# Altium schematic sheet 5_MISC.SchDoc: SmartHalo - Misc
size B; Author: Sébastien Gélinas; Organization: SmartHalo; Address1: 5445 de Gaspé; Address2: Montréal, QC; Address3: Canada; Address4: H2T 3B2; Revision: 1; SheetNumber: 5; SheetTotal: 7
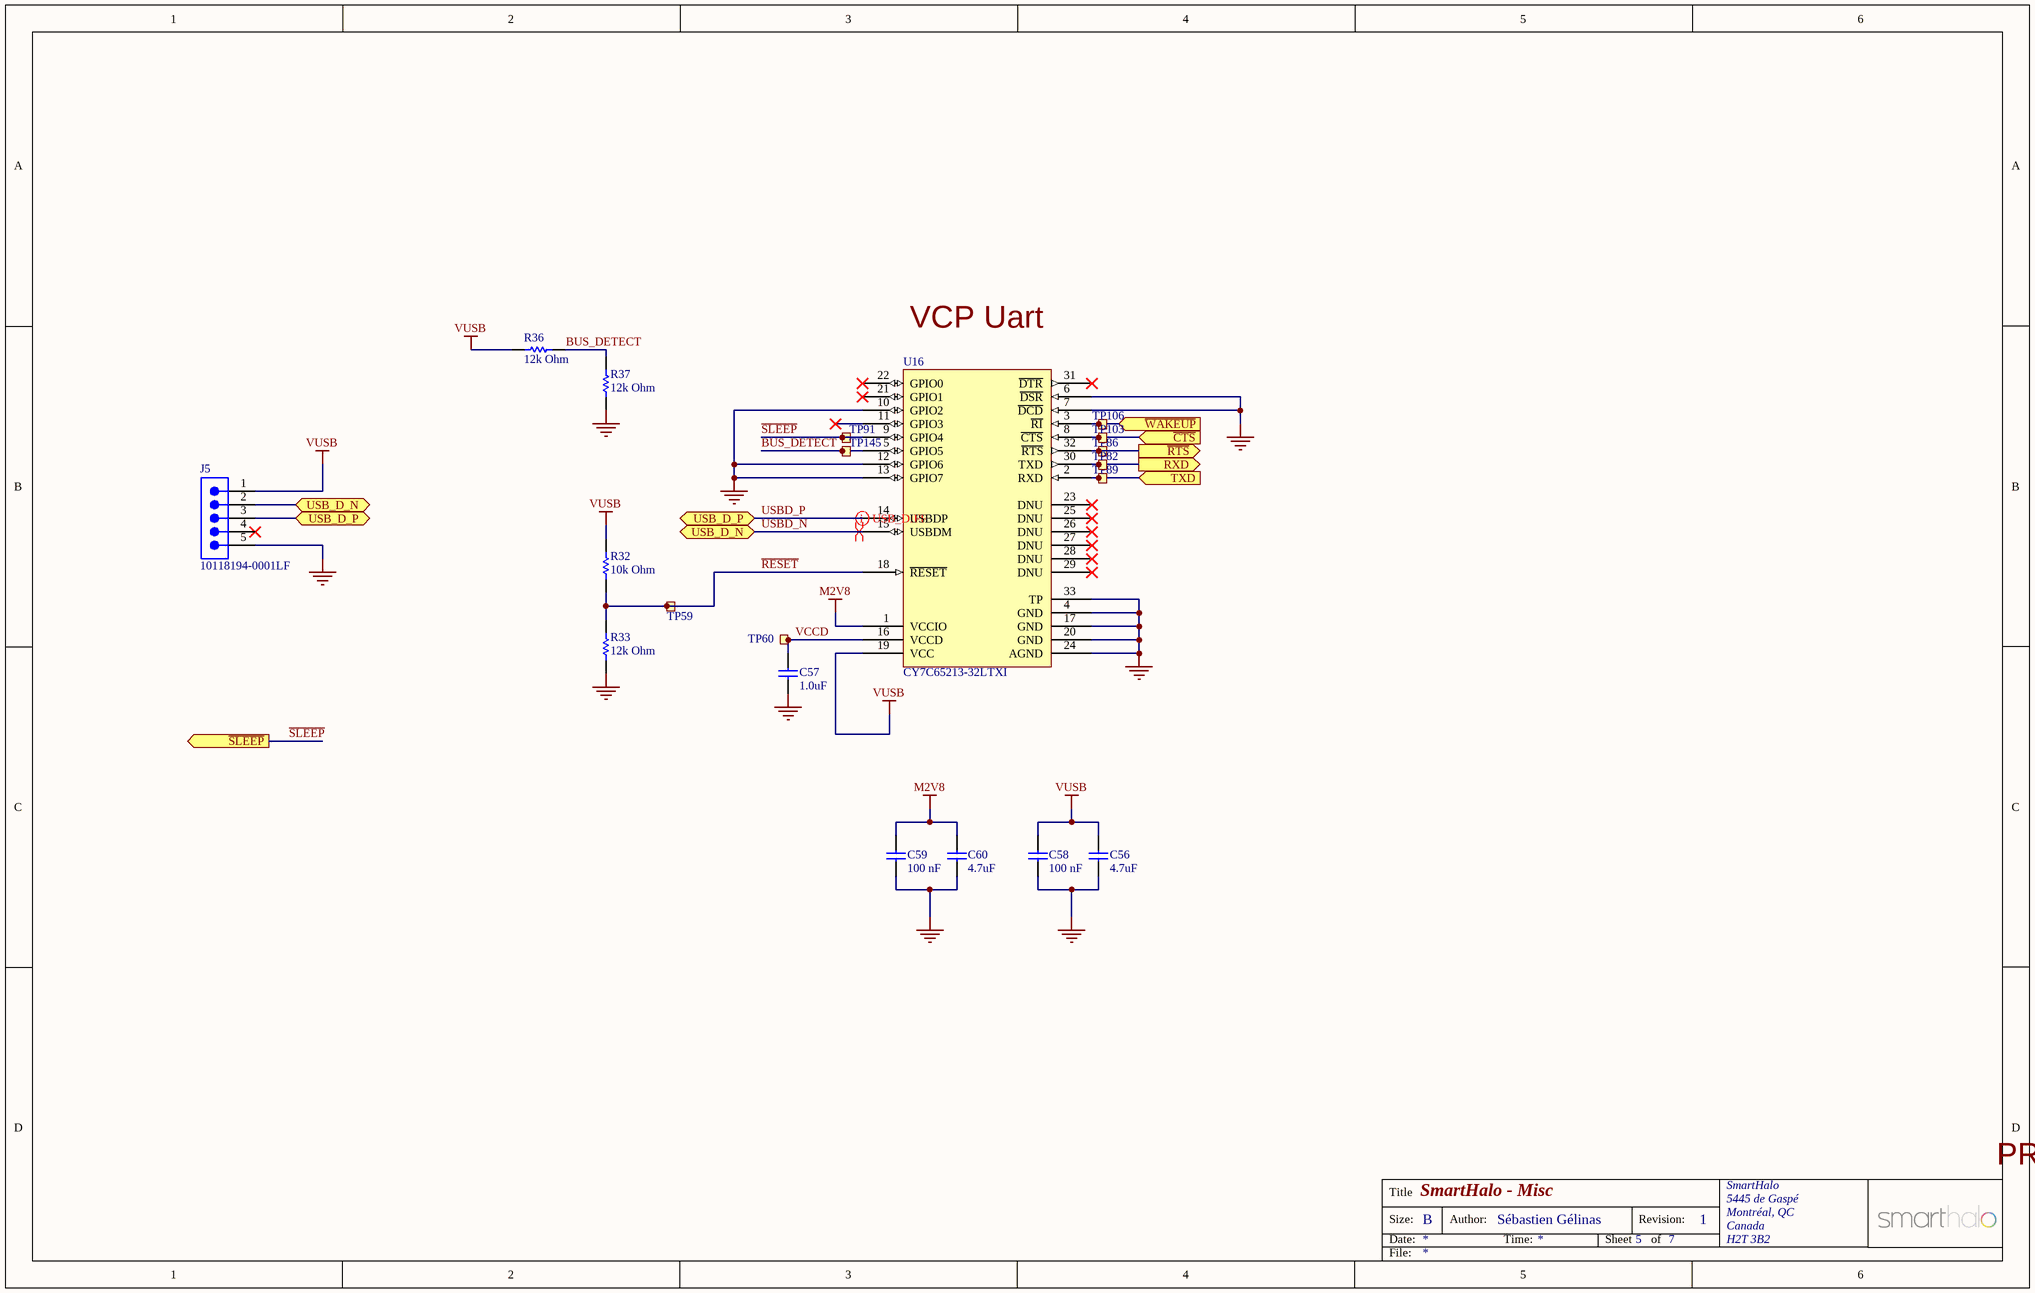
[diagram p0: 5_MISC.SchDoc]

## Parts
C56  4.7uF  [Varitron_CAP0603]
C57  1.0uF  [Varitron_CAP0603]
C58  100 nF  [Varitron_CAP0402]
C59  100 nF  [Varitron_CAP0402]
C60  4.7uF  [Varitron_CAP0603]
J5  10118194-0001LF  [10118194-0001LF]
R32  10k Ohm  [Varitron_RES0402]
R33  12k Ohm  [Varitron_RES0402]
R36  12k Ohm  [Varitron_RES0402]
R37  12k Ohm  [Varitron_RES0402]
TP59  (no value)  [TESTPAD-TH-35mils]  (no BOM)
TP60  (no value)  [TESTPAD-TH-35mils]  (no BOM)
TP82  (no value)  [TESTPAD-TH-35mils]  (no BOM)
TP86  (no value)  [TESTPAD-TH-35mils]  (no BOM)
TP89  (no value)  [TESTPAD-TH-35mils]  (no BOM)
TP91  (no value)  [TESTPAD-TH-35mils]  (no BOM)
TP103  (no value)  [TESTPAD-TH-35mils]  (no BOM)
TP106  (no value)  [TESTPAD-TH-35mils]  (no BOM)
TP145  TP  [TESTPAD-TH-35mils]  (value not drawn)  (no BOM)
U16  CY7C65213-32LTXI  [QFN-32-TP]

## Ports
RXD (out), TXD (in), USB_D_N (bidir), USB_D_P (bidir), ~{CTS} (in), ~{RTS} (out), ~{SLEEP} (out), ~{WAKEUP} (in)

## Nets
GND: C56.2 C57.2 C58.2 C59.2 C60.2 J5.0(ASSY) J5.5 R33.1 R37.2 U16.4(GND) U16.6(~{DSR}) U16.7(~{DCD}) U16.10(GPIO2) U16.12(GPIO6) U16.13(GPIO7) U16.17(GND) U16.20(GND) U16.24(AGND) U16.33(TP)
M2V8: C59.1 C60.1 U16.1(VCCIO)
VUSB: C56.1 C58.1 J5.1 R32.2 R36.2 U16.19(VCC)
BUS_DETECT: R36.1 R37.1 TP145.1 U16.5(GPIO5)
~{CTS}: TP103.1 U16.8(~{CTS}) ; port ~{CTS}
~{RESET}: R32.1 R33.2 TP59.1 U16.18(~{RESET})
~{RTS}: TP86.1 U16.32(~{RTS}) ; port ~{RTS}
RXD: TP82.1 U16.30(TXD) ; port RXD
~{SLEEP}: TP91.1 U16.9(GPIO4) ; port ~{SLEEP}
TXD: TP89.1 U16.2(RXD) ; port TXD
USBD_N: J5.2 U16.15(USBDM) ; port USB_D_N
USBD_P: J5.3 U16.14(USBDP) ; port USB_D_P
VCCD: C57.1 TP60.1 U16.16(VCCD)
~{WAKEUP}: TP106.1 U16.3(~{RI}) ; port ~{WAKEUP}

Not connected (* = marked no-connect by the designer): J5 4*; U16 11(GPIO3)* 21(GPIO1)* 22(GPIO0)* 23(DNU)* 25(DNU)* 26(DNU)* 27(DNU)* 28(DNU)* 29(DNU)* 31(~{DTR})*

## Layout directives
differential pair: USBD_N, USBD_P

## Notes on the sheet
- (near U16) VCP Uart
- PRELIMINARY: DO NOT USE FOR PRODUCTION
- Title
- Size:
- Date:
- B
- Author:
- Time:
- Sheet
- Revision:
- of
- File:

## Library data of the parts
C56 C60 = Varitron_CAP0603: 4.7uF 10V X7R 10% 0603 (1608 Metric)  SMD; Case-EIA: 0603; Case-Metric: 1608; Tolerance: 10%; Technology: SMT; Temperature Coefficient: X7R; Voltage Rating: 10V; Value: 4.7uF
C57 = Varitron_CAP0603: 1uF 10V X7R 10% 0603 (1608 Metric)  SMD; Case-EIA: 0603; Case-Metric: 1608; Tolerance: 10%; Technology: SMT; Temperature Coefficient: X7R; Voltage Rating: 10V; Value: 1.0uF
C58 C59 = Varitron_CAP0402: 100 nF 10V X7R 10% 0402 (1005 Metric)  SMD; Case-EIA: 0402; Case-Metric: 1005; Tolerance: 10%; Technology: SMT; Temperature Coefficient: X7R; Voltage Rating: 10V; Value: 100 nF
J5 = 10118194-0001LF: Micro USB B Type Receptacle; Manufacturer: Amphenol FCI; Manufacturer Part Number: 10118194-0001LF; Part Number: 10118194-0001LF
R32 = Varitron_RES0402: 10K 0.063W 5% 0402 (1005 Metric)  SMD; Case-Metric: 1005; Case-EIA: 0402; Tolerance: 5%; Technology: SMT; Power: 0.063W; Value: 10k Ohm
R33 R36 R37 = Varitron_RES0402: 12K 0.063W 5% 0402 (1005 Metric)  SMD; Case-Metric: 1005; Case-EIA: 0402; Tolerance: 5%; Technology: SMT; Power: 0.063W; Value: 12k Ohm
TP59 TP60 TP82 TP86 TP89 TP91 TP103 TP106 = TESTPAD_TH_35mils: Testpoint, through hole, 35 mils; Value: TP
TP145 = TESTPAD_TH_35mils: Testpoint, through hole, 35 mils; Value: TP
U16 = CY7C65213-32LTXI: IC USB TO UART BRIDGE 32QFN; Manufacturer: Cypress; Manufacturer Part Number: CY7C65213-32LTXI; Part Number: CY7C65213-32LTXI